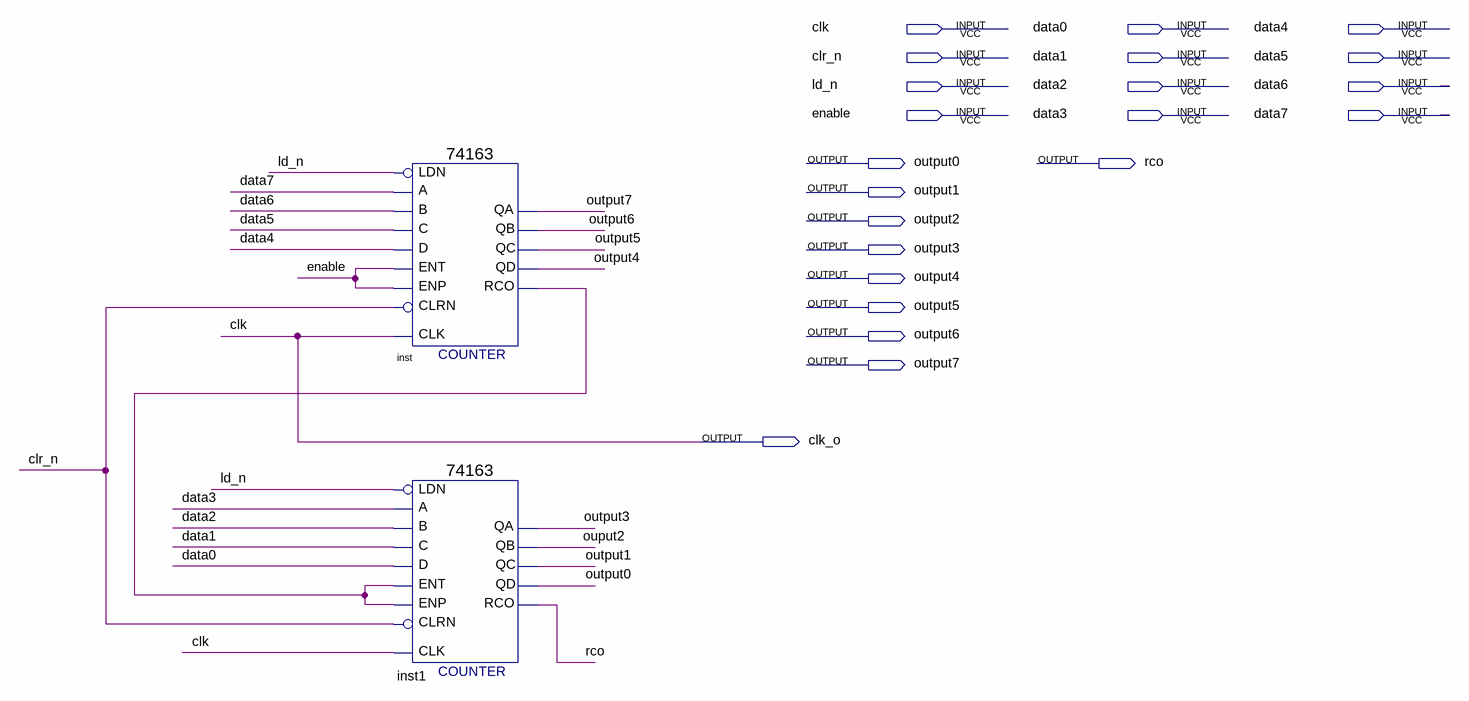
[diagram p0: schematic sheet]
// Quartus schematic Counter.bdf as structural Verilog: 2 symbols, 22 pins
module Counter (
  input  clk,
  input  data0,
  input  data4,
  input  clr_n,
  input  data1,
  input  data5,
  input  ld_n,
  input  data2,
  input  data6,
  input  enable,
  input  data3,
  input  data7,
  output output0,
  output rco,
  output output1,
  output output2,
  output output3,
  output output4,
  output output5,
  output output6,
  output output7,
  output clk_o
);

  wire inst_rco, ouput2;

  \74163  inst (
    .C(data5), .B(data6), .A(data7), .ENT(enable), .D(data4), .CLRN(clr_n), .CLK(clk), .ENP(enable),
    .LDN(ld_n), .QA(output7), .QB(output6), .QC(output5), .QD(output4), .RCO(inst_rco));
  \74163  inst1 (
    .C(data1), .B(data2), .A(data3), .ENT(inst_rco), .D(data0), .CLRN(clr_n), .CLK(clk), .ENP(inst_rco),
    .LDN(ld_n), .QA(output3), .QB(ouput2), .QC(output1), .QD(output0), .RCO(rco));

  assign clk_o = clk;
endmodule
